# Altium project ESD_project.PrjPcb
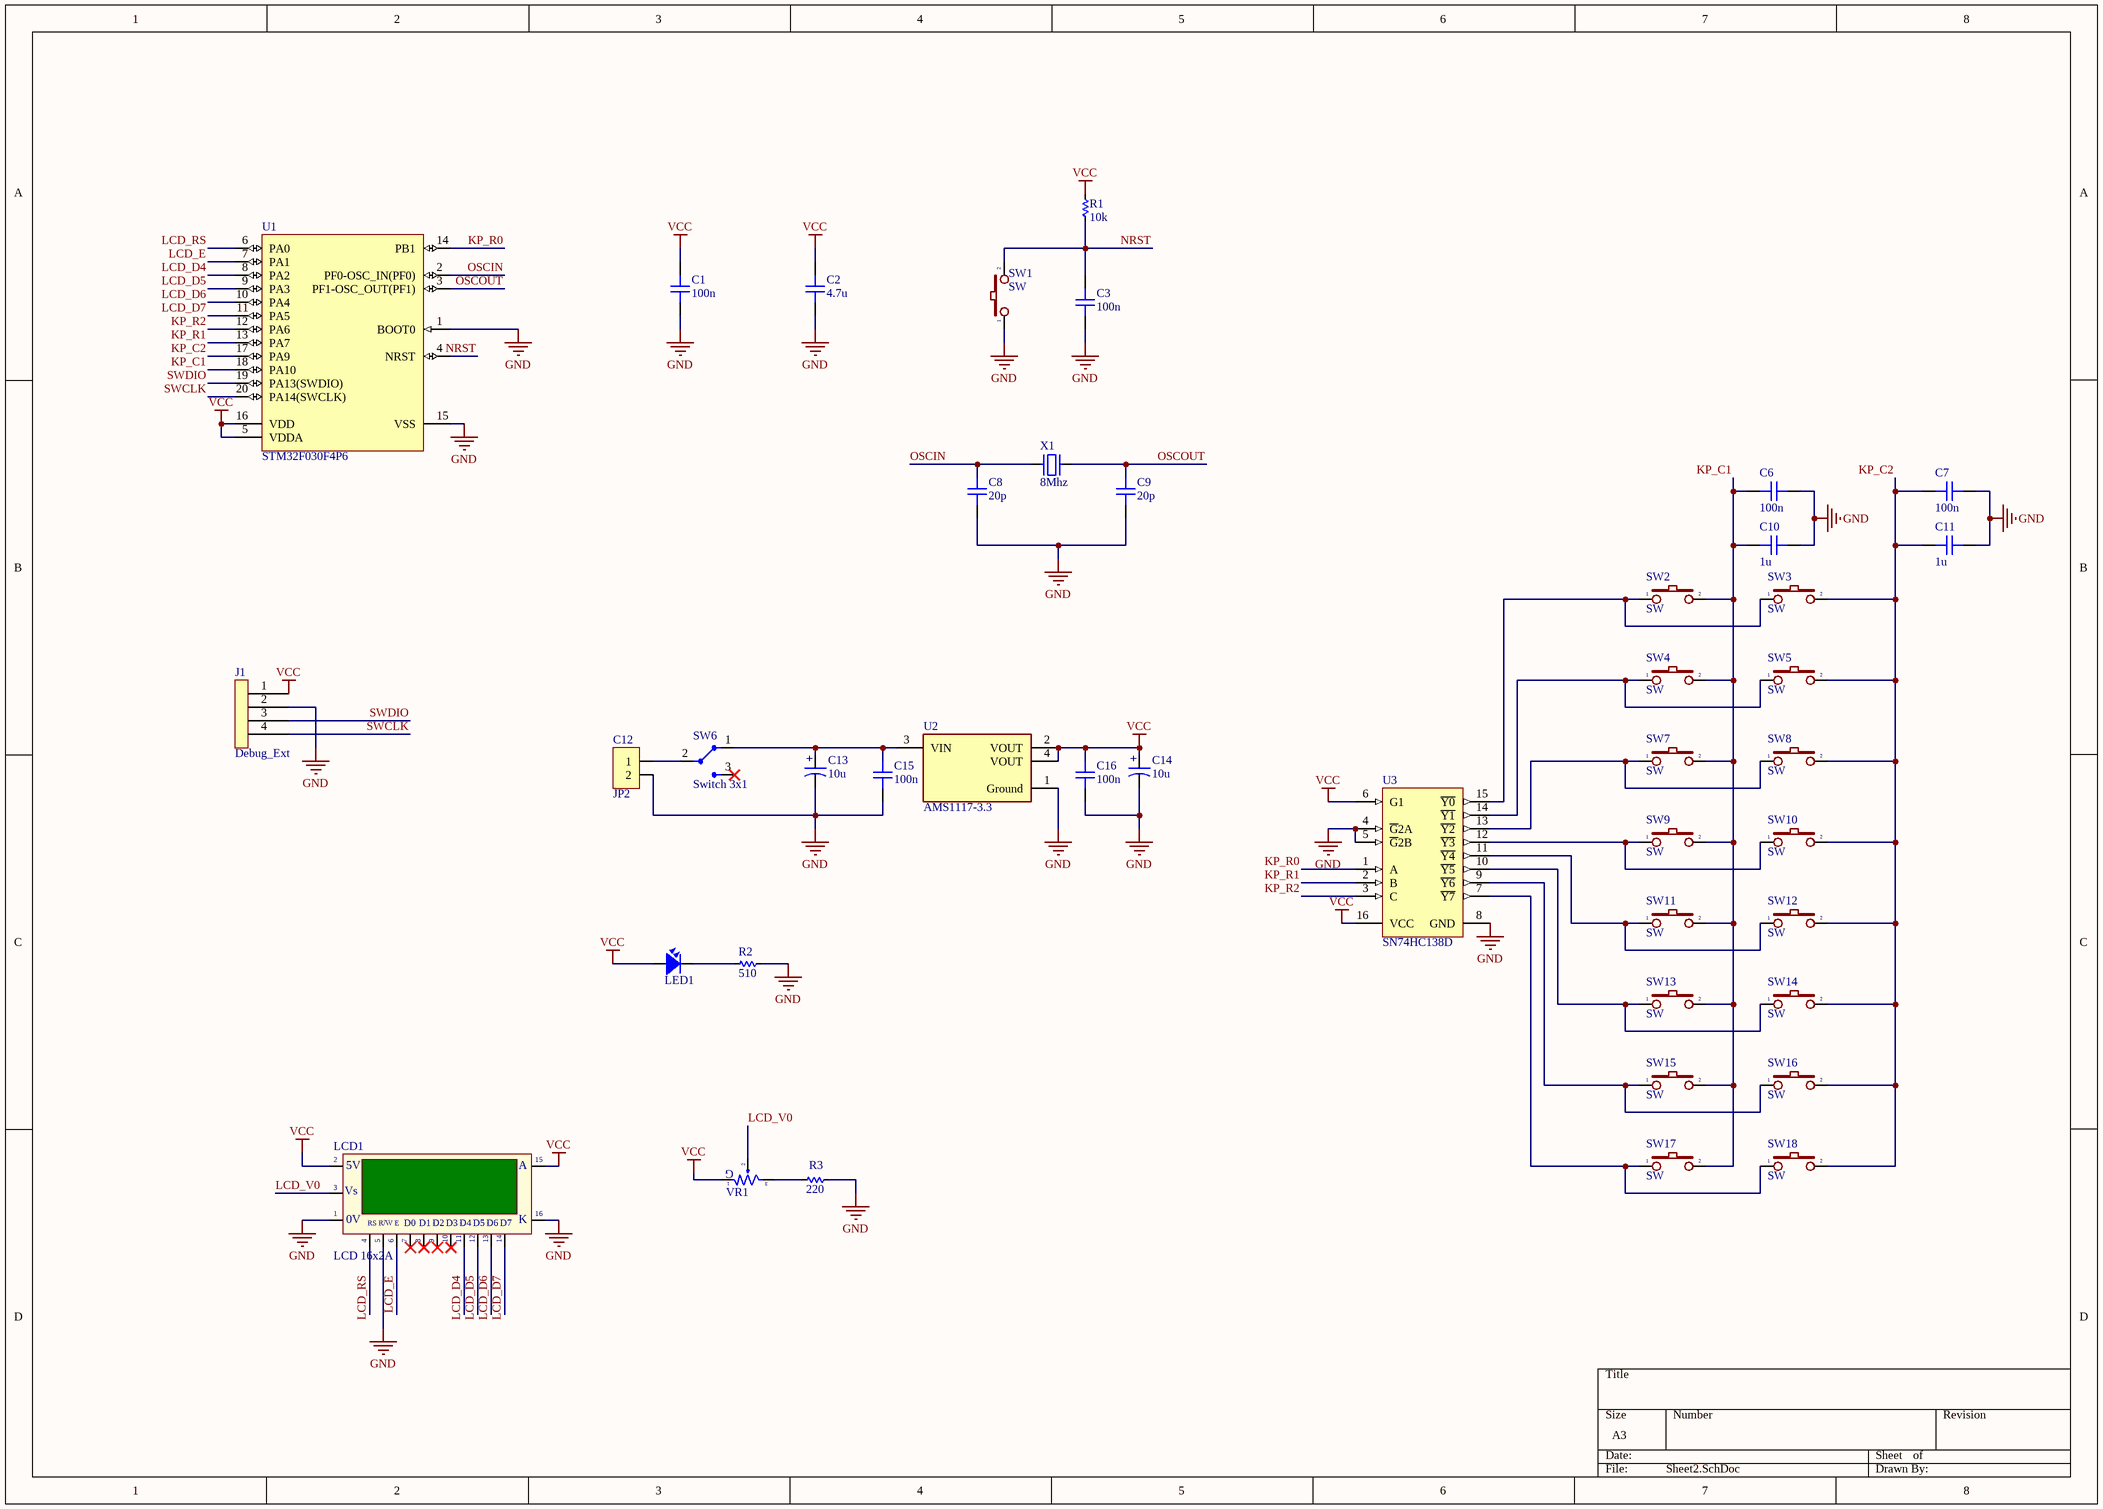
[diagram p0: Sheet2.SchDoc]
1 sheet, 43 parts. Net scope: global (net labels, ports and power ports of the same name join across sheets).
Board file: PCB1.PcbDoc

## Sheet Sheet2.SchDoc
size A3; SheetNumber: 1; SheetTotal: 1

### Parts
C1  100n  [CAP_1206]
C2  4.7u  [CAP_1206]
C3  100n  [CAP_1206]
C6  100n  [CAP_1206]
C7  100n  [CAP_1206]
C8  20p  [CAP_1206]
C9  20p  [CAP_1206]
C10  1u  [CAP_1206]
C11  1u  [CAP_1206]
C12  JP2  [JP2-C1T]
C13  10u  [CAP-ALU-SMD-5x5.5x1.4]
C14  10u  [CAP-ALU-SMD-5x5.5x1.4]
C15  100n  [CAP_1206]
C16  100n  [CAP_1206]
J1  Debug_Ext  [JP4-C1T]
LCD1  LCD 16x2A  [LCD16X2N]
LED1  LED  [LED-1206-Red]  (value not drawn)
R1  10k  [RES-SMD-1206]
R2  510  [RES-SMD-1206]
R3  220  [RES-SMD-1206]
SW1  SW  [SW2-SMD-2.5mm]
SW2  SW  [SW1-DIP-12x12x8-Yellow]
SW3  SW  [SW1-DIP-12x12x8-Yellow]
SW4  SW  [SW1-DIP-12x12x8-Yellow]
SW5  SW  [SW1-DIP-12x12x8-Yellow]
SW6  Switch 3x1  [SS12D10]
SW7  SW  [SW1-DIP-12x12x8-Yellow]
SW8  SW  [SW1-DIP-12x12x8-Yellow]
SW9  SW  [SW1-DIP-12x12x8-Yellow]
SW10  SW  [SW1-DIP-12x12x8-Yellow]
SW11  SW  [SW1-DIP-12x12x8-Yellow]
SW12  SW  [SW1-DIP-12x12x8-Yellow]
SW13  SW  [SW1-DIP-12x12x8-Yellow]
SW14  SW  [SW1-DIP-12x12x8-Yellow]
SW15  SW  [SW1-DIP-12x12x8-Yellow]
SW16  SW  [SW1-DIP-12x12x8-Yellow]
SW17  SW  [SW1-DIP-12x12x8-Yellow]
SW18  SW  [SW1-DIP-12x12x8-Yellow]
U1  STM32F030F4P6  [STM-TSSOP20_L]
U2  AMS1117-3.3  [FP-AMS1117-IPC_A]
U3  SN74HC138D  [D0016A_N]
VR1  (no value)  [VR 3x3]
X1  8Mhz  [XT2-SMD]

### Nets
GND: C1.1 C2.1 C3.1 C6.2 C7.2 C8.1 C9.1 C10.2 C11.2 C12.2 C13.2 C14.2 C15.1 C16.1 J1.2 LCD1.1(GND) LCD1.5(R/~{W}) LCD1.16(K) R2.2 R3.2 SW1.1 U1.1(BOOT0) U1.15(VSS) U2.1(Ground) U3.4(~{G}2A) U3.5(~{G}2B) U3.8(GND)
VCC: C1.2 C2.2 C14.1 C16.2 J1.1 LCD1.2(VDD) LCD1.15(A) LED1.1 R1.1 U1.5(VDDA) U1.16(VDD) U2.2(VOUT) U2.4(VOUT) U3.6(G1) U3.16(VCC) VR1.1
KP_C1: C6.1 C10.1 SW2.2 SW4.2 SW7.2 SW9.2 SW11.2 SW13.2 SW15.2 SW17.2 U1.18(PA10)
KP_C2: C7.1 C11.1 SW3.2 SW5.2 SW8.2 SW10.2 SW12.2 SW14.2 SW16.2 SW18.2 U1.17(PA9)
KP_R0: U1.14(PB1) U3.1(A)
KP_R1: U1.13(PA7) U3.2(B)
KP_R2: U1.12(PA6) U3.3(C)
LCD_D4: LCD1.11(D4) U1.8(PA2)
LCD_D5: LCD1.12(D5) U1.9(PA3)
LCD_D6: LCD1.13(D6) U1.10(PA4)
LCD_D7: LCD1.14(D7) U1.11(PA5)
LCD_E: LCD1.6(~{EN}) U1.7(PA1)
LCD_RS: LCD1.4(RS) U1.6(PA0)
LCD_V0: LCD1.3(VEE) VR1.2
NRST: C3.2 R1.2 SW1.2 U1.4(NRST)
OSCIN: C8.2 U1.2(PF0-OSC_IN(PF0)) X1.1
OSCOUT: C9.2 U1.3(PF1-OSC_OUT(PF1)) X1.2
SWCLK: J1.4 U1.20(PA14(SWCLK))
SWDIO: J1.3 U1.19(PA13(SWDIO))
NetC12_1: C12.1 SW6.2
NetC13_1: C13.1 C15.2 SW6.1 U2.3(VIN)
NetLED1_2: LED1.2 R2.1
NetR3_1: R3.1 VR1.3
NetSW2_1: SW2.1 SW3.1 U3.15(~{Y0})
NetSW4_1: SW4.1 SW5.1 U3.14(~{Y1})
NetSW7_1: SW7.1 SW8.1 U3.13(~{Y2})
NetSW9_1: SW9.1 SW10.1 U3.12(~{Y3})
NetSW11_1: SW11.1 SW12.1 U3.11(~{Y4})
NetSW13_1: SW13.1 SW14.1 U3.10(~{Y5})
NetSW15_1: SW15.1 SW16.1 U3.9(~{Y6})
NetSW17_1: SW17.1 SW18.1 U3.7(~{Y7})

Not connected (* = marked no-connect by the designer): LCD1 7(D0)* 8(D1)* 9(D2)* 10(D3)*; SW6 3(I/O2)*

### Notes on the sheet
- (in symbol LCD16x2A) 5V; Vs; |; 0V; R/W; E
- (in symbol pol_cap) +
- (in symbol VR-S) G

### Library data of the parts
C1-C3 C6-C11 C15 C16 = CAP_1206: Capacitor SMD 1206; Manufacturer: *; Manufacturer Part Number: *; Distributor Link: *; LCSC: *; Rating: *; Dielectric: *
C12 = JP2: WR-PHD 2.54 mm Angled Socket Header; Manufacturer: W¨¹rth Elektronik eiSos GmbH; partNo: 613002143121; ComponentLink1 Description: Manufacturer; ComponentLink2 Description: Datasheet; NoPins: 02; Created Date: 29 March 2013; ComponentLink1URL: http://www.we-online.com; ComponentLink2URL: http://katalog.we-online.de/em/datasheet/6130xx143121.pdf; Created by: Karrer Zheng
C13 C14 = pol_cap
J1 = Jumper4
LCD1 = LCD16x2A: LCD dipslay 16 char, 2 line; Value: LCD16x2A
LED1 = LED SMD: Value: LED 3 - 5 ly 2 Colour
R1-R3 = Res-SMD: Resistor; Manufacturer: Generic Components; Class: Passive; Published: 08/06/2000; Publisher: Altium Hobart Technology Centre
SW1-SW5 SW7-SW18 = SW2: Switch button 2 pin; Value: SW chip 2 pin
SW6 = SW3x1: Value: Switch 4x2
U1 = CMP-0304-00039-2: ARM Cortex-M0 32-bit MCU, 16 KB Flash, 4 KB Internal RAM, 15 I/Os, 20-pin TSSOP, -40 to 85 degC, Tube; I/Os (High Current): 15; FLASH Size (Prog) (kB): 16; Internal RAM Size (kB): 4; Supply Voltage(Vcc) min (V): 2.4; Operating Frequency(F) (Processor speed) (MHz): 48; ComponentLink2URL: http://www.st.com/st-web-ui/static/active/en/resource/technical/document/datasheet/DM00088500.pdf; Core: ARM Cortex-M0; ComponentLink2Description: Datasheet; PackageDescription: 20-Pin Thin Shrink Small Outline Package, 6.5 x 4.4 mm Body, 0.65 mm Pitch; Mounting Technology: Surface Mount; ComponentLink1URL: http://www.st.com/web/en/home.html; PackageVersion: Rev. 1, 11/2012; ComponentLink3Description: Package Specification; PartNumber: STM32F030F4P6; ComponentLink3URL: http://www.st.com/st-web-ui/static/active/en/resource/technical/document/datasheet/DM00065136.pdf; DatasheetVersion: Rev. 1; PackageReference: TSSOP20; ComponentLink1Description: Manufacturer URL; Packing: Tube
U2 = CMP-209535-000001-1: LDO Voltage Regulators 1A, 3.3V; Manufacturer: Advanced Monolithic Systems; Dropout Voltage: 1.1V; Output Type: Fixed; Nominal Supply Current: 5mA; Max Power Dissipation: 1.2W; Max Supply Voltage: 15V; Number Of Outputs: 1; Standoff Height: 0.64mm; Max Junction Temp: +125°C; Height: 1.8mm; Package: AMS1117; Device Class L2: Power Management ICs; ComponentLink2Description: Datasheet; ComponentLink2URL: http://www.advanced-monolithic.com/pdf/ds1117.pdf; Category: IC; RoHS: TRUE; Automotive: No; Device Class L1: Integrated Circuits (ICs); Output Current: 1A; Device Class L3: Voltage Regulators - Linear; Temperature: -40°C to +125°C; Output Voltage: 3.3V; Manufacturer Part Number: AMS1117-3.3; Temperature Range Low: -40°C; Octopart: https://octopart.com/ams1117-3.3-advanced+monolithic+systems-25899300; Lead Free: Yes; Ipc Land Pattern Name: SOT229P700X180-4; Temperature Range High: +125°C
U3 = CMP-1633-00243-2: 3-Line To 8-Line Decoders/Demultiplexers, D0016A, TUBE; Manufacturer: Texas Instruments; Technology Family: HC; Function: Decoder/Demultiplexer; VCC(Max)(V): 6; Output Drive (IOL/IOH)(Max)(mA): 5.2/-5.2; Voltage(Nom)(V): 3.3,5; VCC(Min)(V): 2; Input Type: LVTTL/CMOS; Rating: Catalog; ICC @ Nom Voltage(Max)(mA): 0.08; Configuration: 3：8; Bits(#): 8; Channels(#): 1; tpd @ Nom Voltage(Max)(ns): 45; F @ Nom Voltage(Max)(Mhz): 28; Schmitt Trigger: No; Output Type: CMOS; Type: Standard; Operating Temperature Range(C): -40 to 85; Generic Part Number: SN74HC138; Code_JEDEC: MS-012 variation AC; DatasheetVersion: SCLS107E; PackageReference: D0016A
VR1 = VR-S: Var Resistor; Value: Volume 50k
X1 = XT2: Crystal, 32.768 KHz, -40 to 85 degC, 3.2 x 1.5 x 0.9 mm SMD; Value: 4Mhz